# Altium schematic sheet SENSOR.SchDoc
size A4
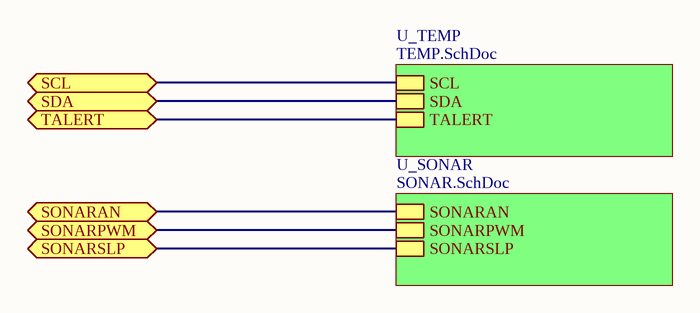
[diagram p0: SENSOR.SchDoc]

## Sub-sheets
U_SONAR = SONAR.SchDoc: SONARAN, SONARPWM, SONARSLP
U_TEMP = TEMP.SchDoc: SCL, SDA, TALERT

## Ports
SCL, SDA, SONARAN, SONARPWM, SONARSLP, TALERT

## Nets
SCL: port SCL, sheet U_TEMP/SCL
SDA: port SDA, sheet U_TEMP/SDA
SONARAN: port SONARAN, sheet U_SONAR/SONARAN
SONARPWM: port SONARPWM, sheet U_SONAR/SONARPWM
SONARSLP: port SONARSLP, sheet U_SONAR/SONARSLP
TALERT: port TALERT, sheet U_TEMP/TALERT